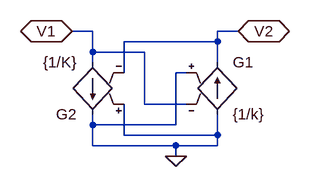
[diagram p0: schematic Draft3.asc]
Draft3.asc, the LTspice schematic file:
Version 4
SHEET 1 880 680
WIRE 64 48 32 48
WIRE 288 48 256 48
WIRE 256 64 256 48
WIRE 256 64 112 64
WIRE 64 80 64 48
WIRE 144 80 64 80
WIRE 64 96 64 80
WIRE 256 96 256 64
WIRE 112 112 112 64
WIRE 208 112 192 112
WIRE 144 160 144 80
WIRE 208 160 144 160
WIRE 64 192 64 176
WIRE 192 192 192 112
WIRE 192 192 64 192
WIRE 112 208 112 160
WIRE 256 208 256 176
WIRE 256 208 112 208
WIRE 64 224 64 192
WIRE 192 224 64 224
WIRE 256 224 256 208
WIRE 256 224 192 224
WIRE 192 240 192 224
FLAG 32 48 V1
IOPIN 32 48 BiDir
FLAG 288 48 V2
IOPIN 288 48 BiDir
FLAG 192 240 0
SYMBOL g 256 80 R0
SYMATTR InstName G1
SYMATTR Value {1/k}
SYMBOL g 64 192 R180
SYMATTR InstName G2
SYMATTR Value {1/K}

The netlist it stands for:
* Draft3.asc
G1 0 V2 0 V1 {1/k}
G2 V1 0 0 V2 {1/K}
.backanno
.end